# Altium schematic sheet Rockblock.SchDoc
size A
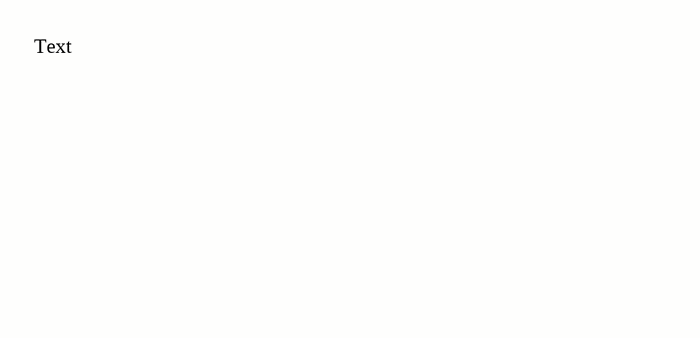
[diagram p0: Rockblock.SchDoc]

## Notes on the sheet
- Text